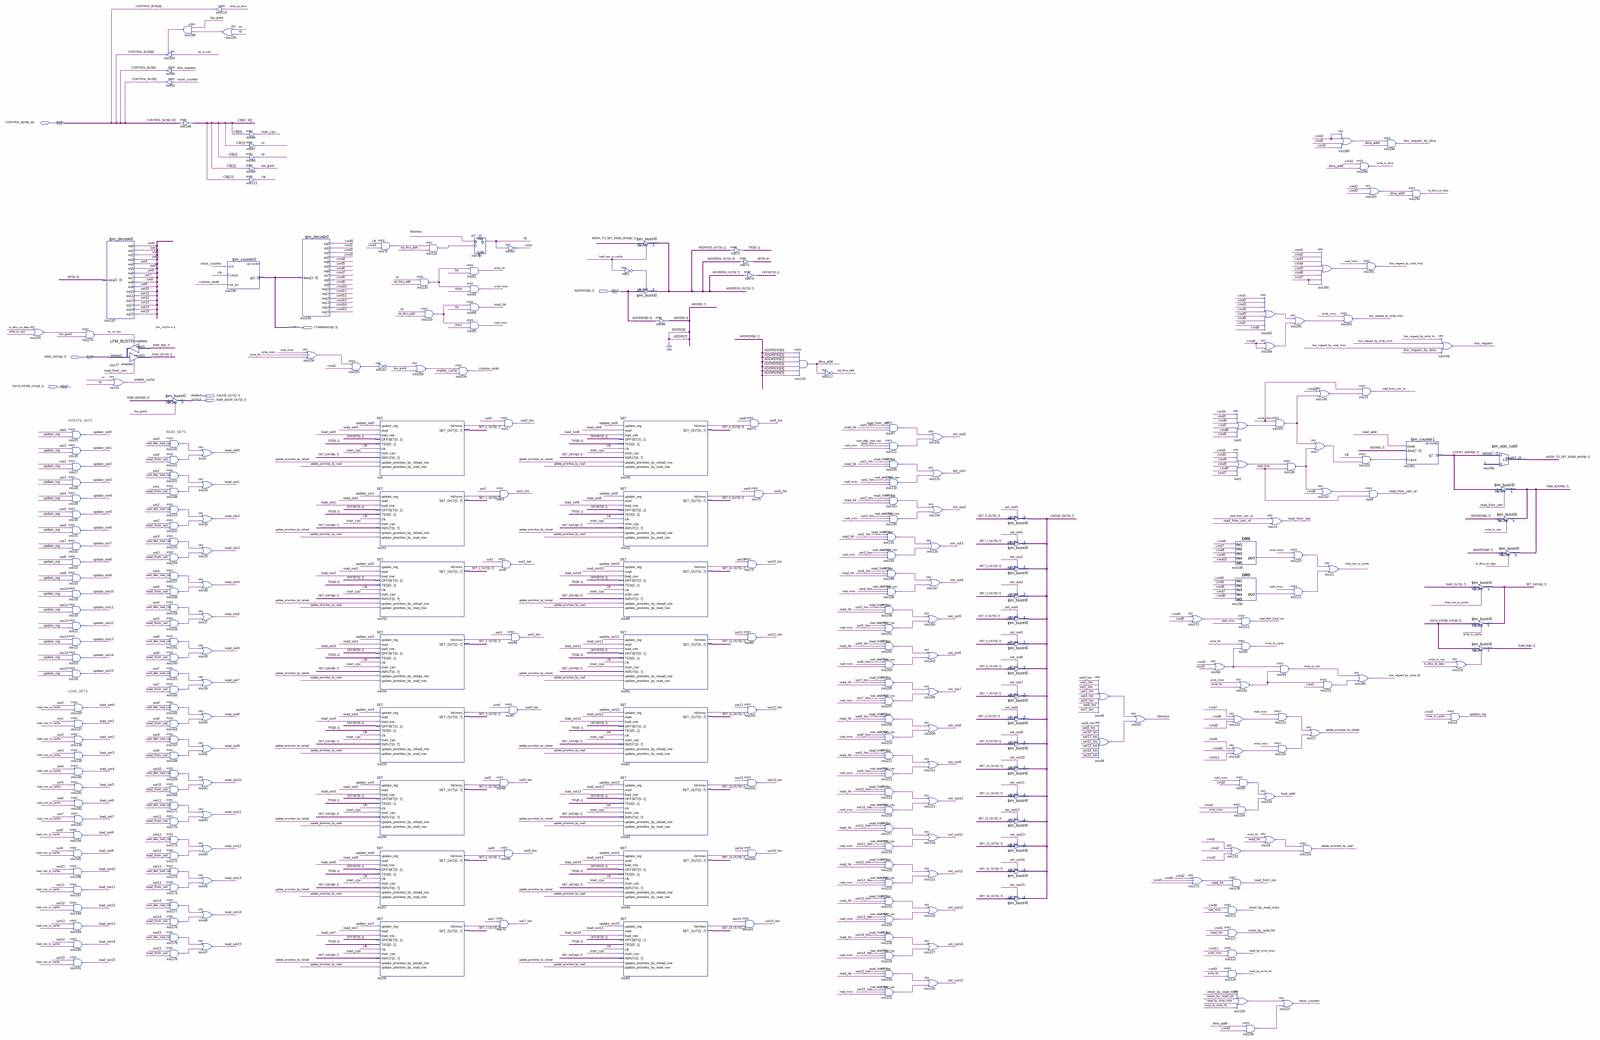
[diagram p0: schematic sheet, whole]
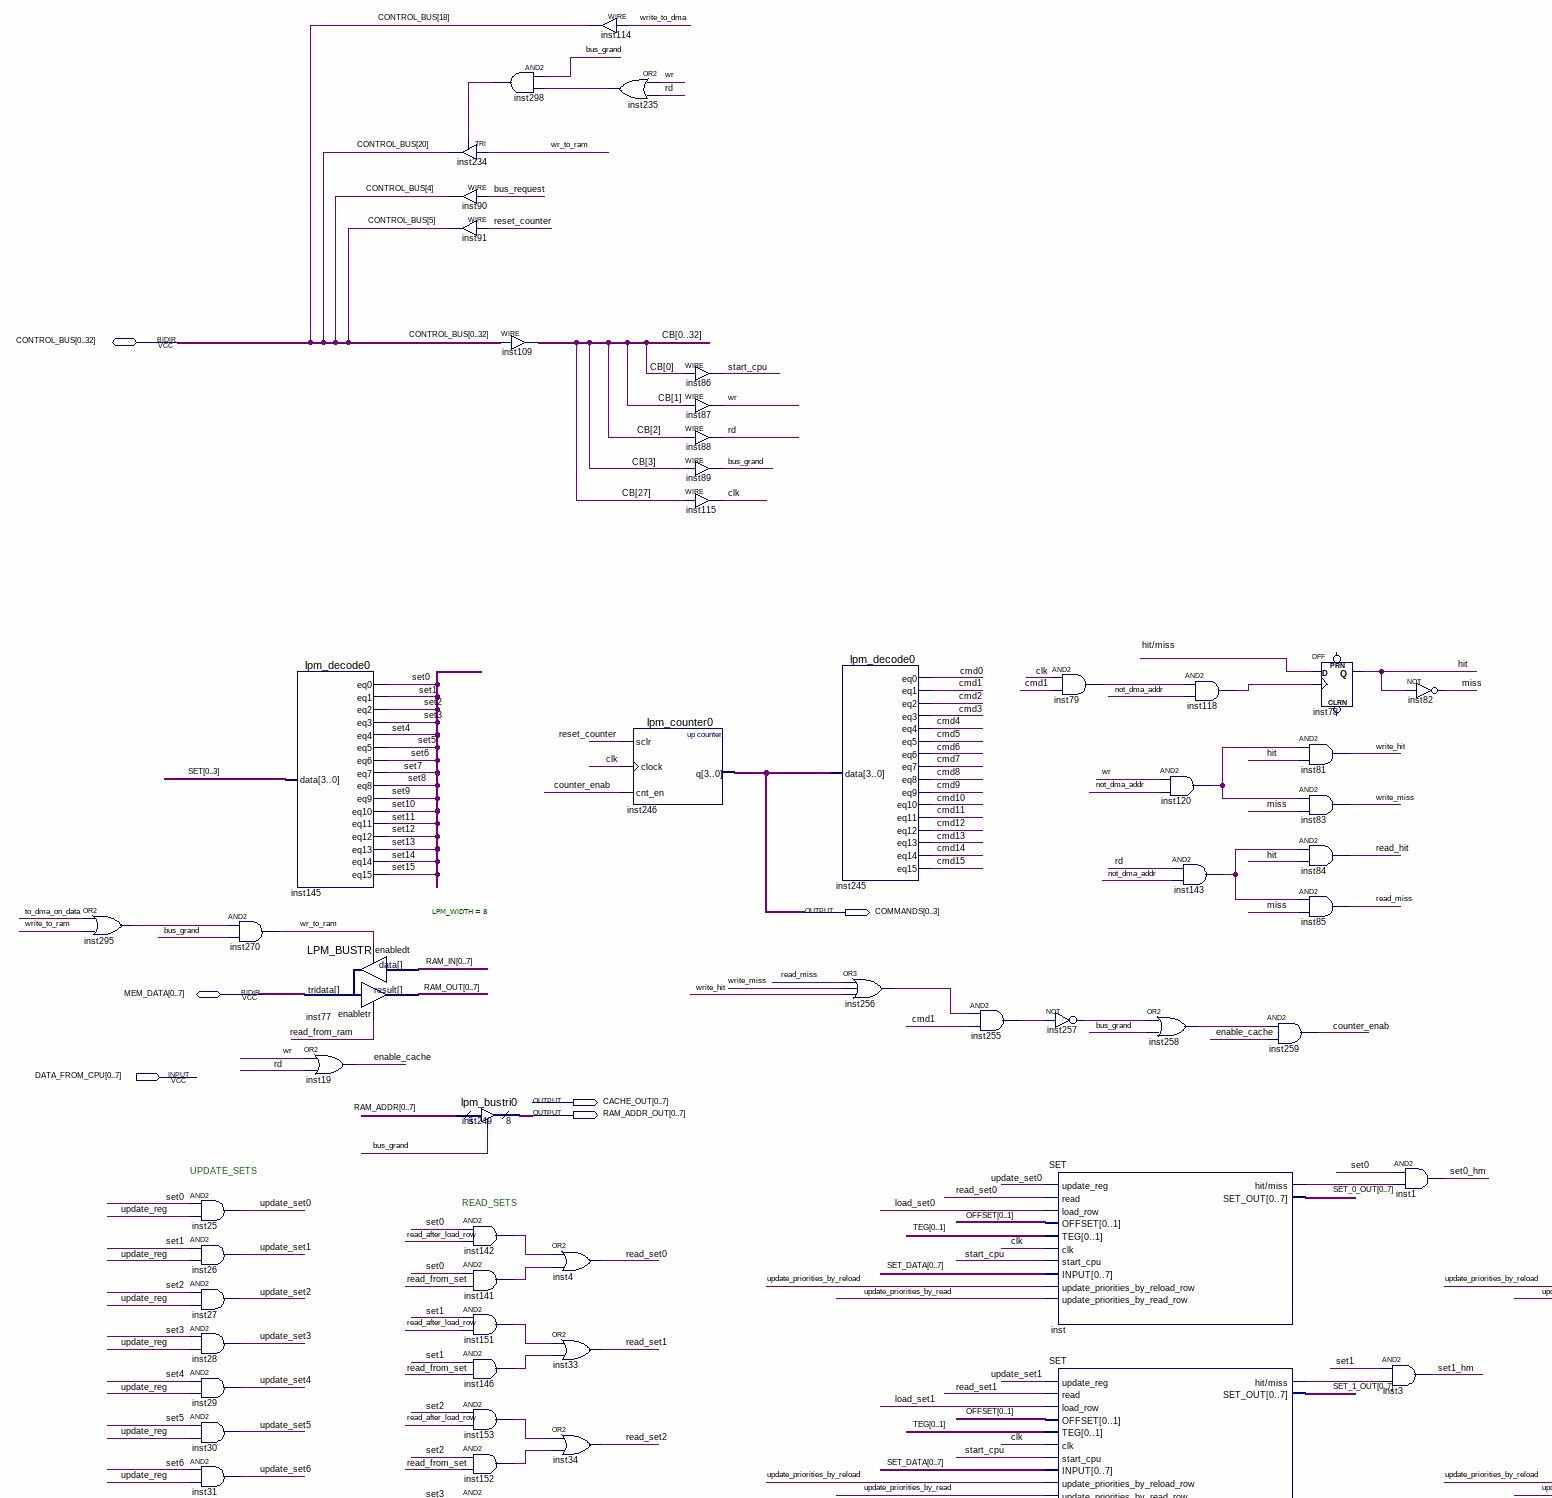
[diagram p1: schematic sheet, upper left part]
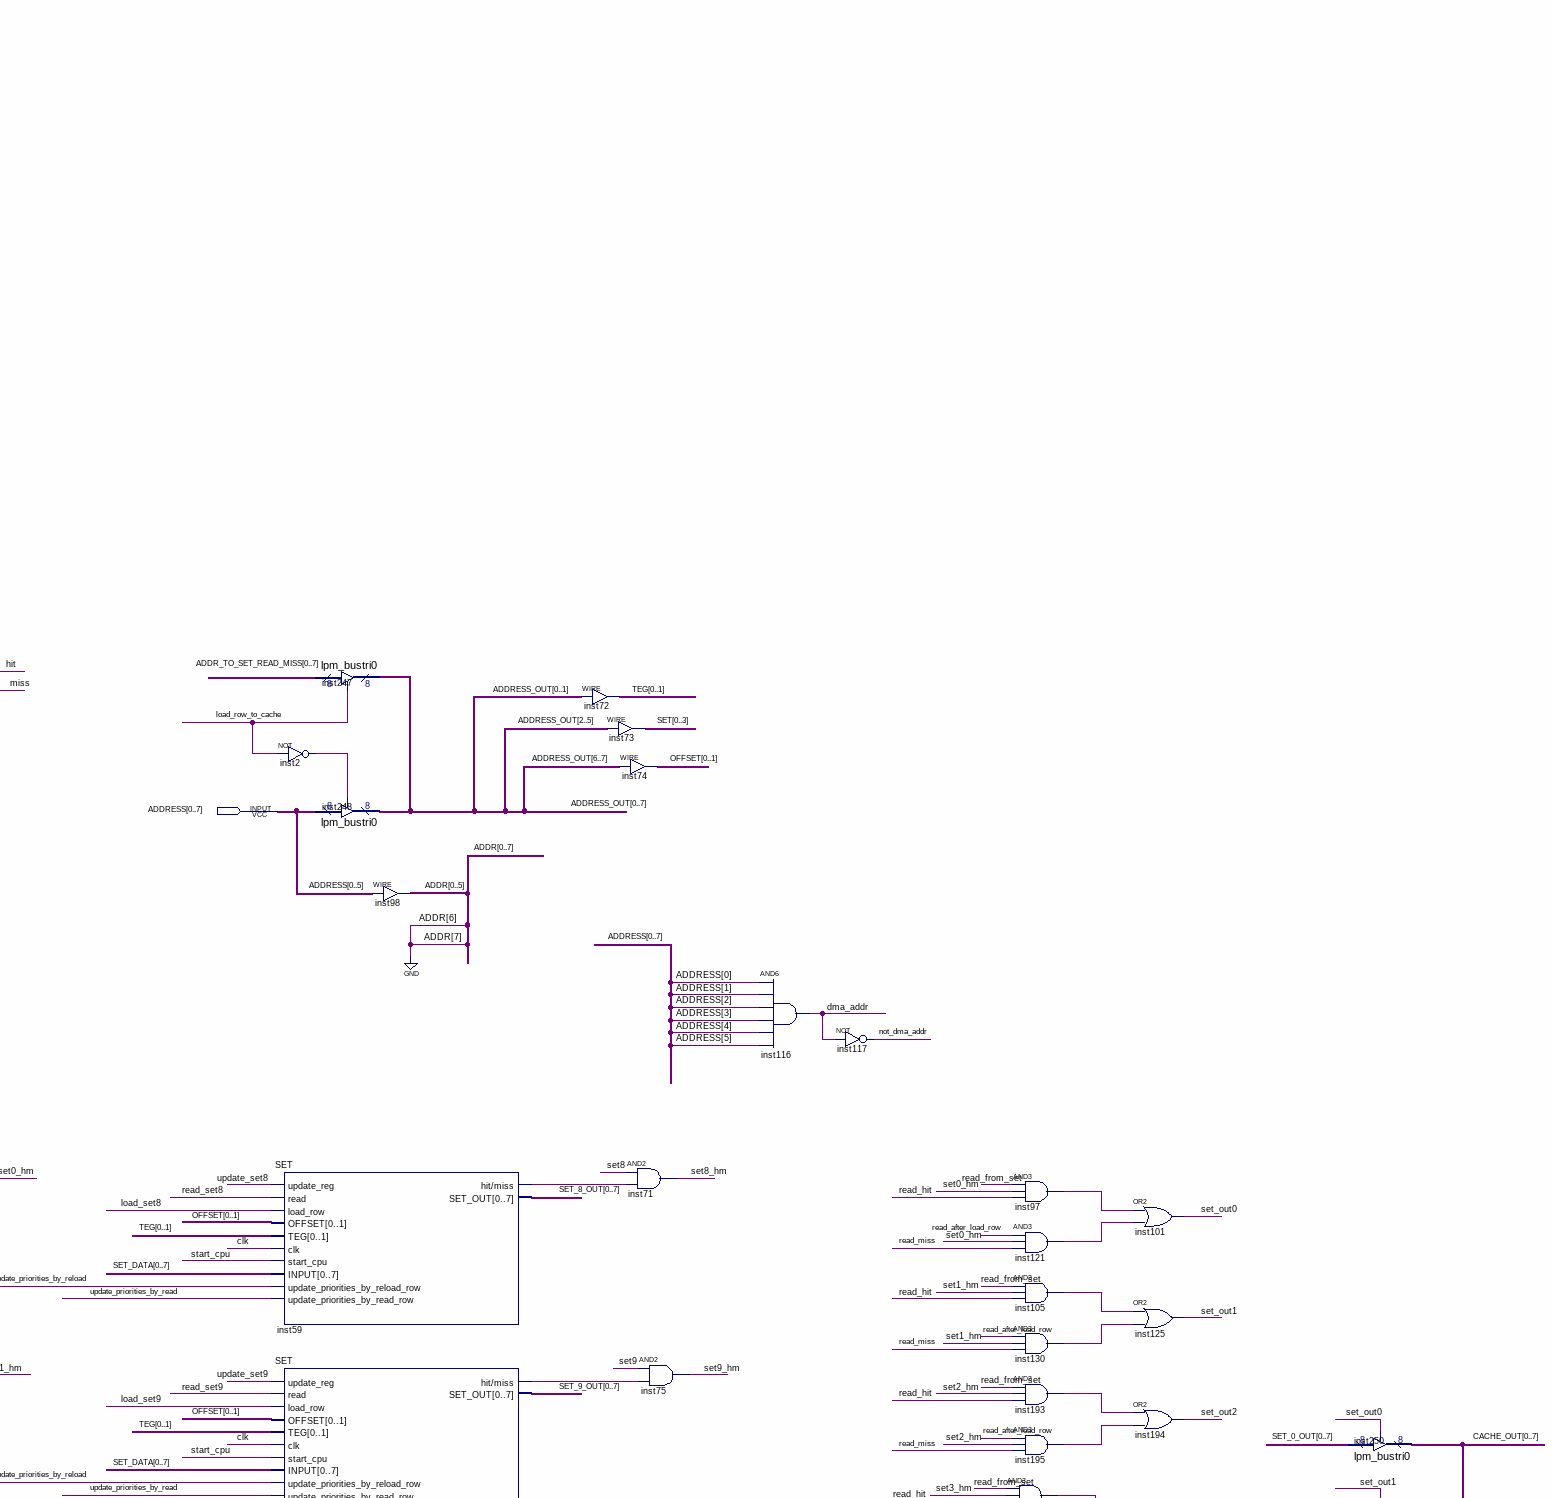
[diagram p2: schematic sheet, upper centre part]
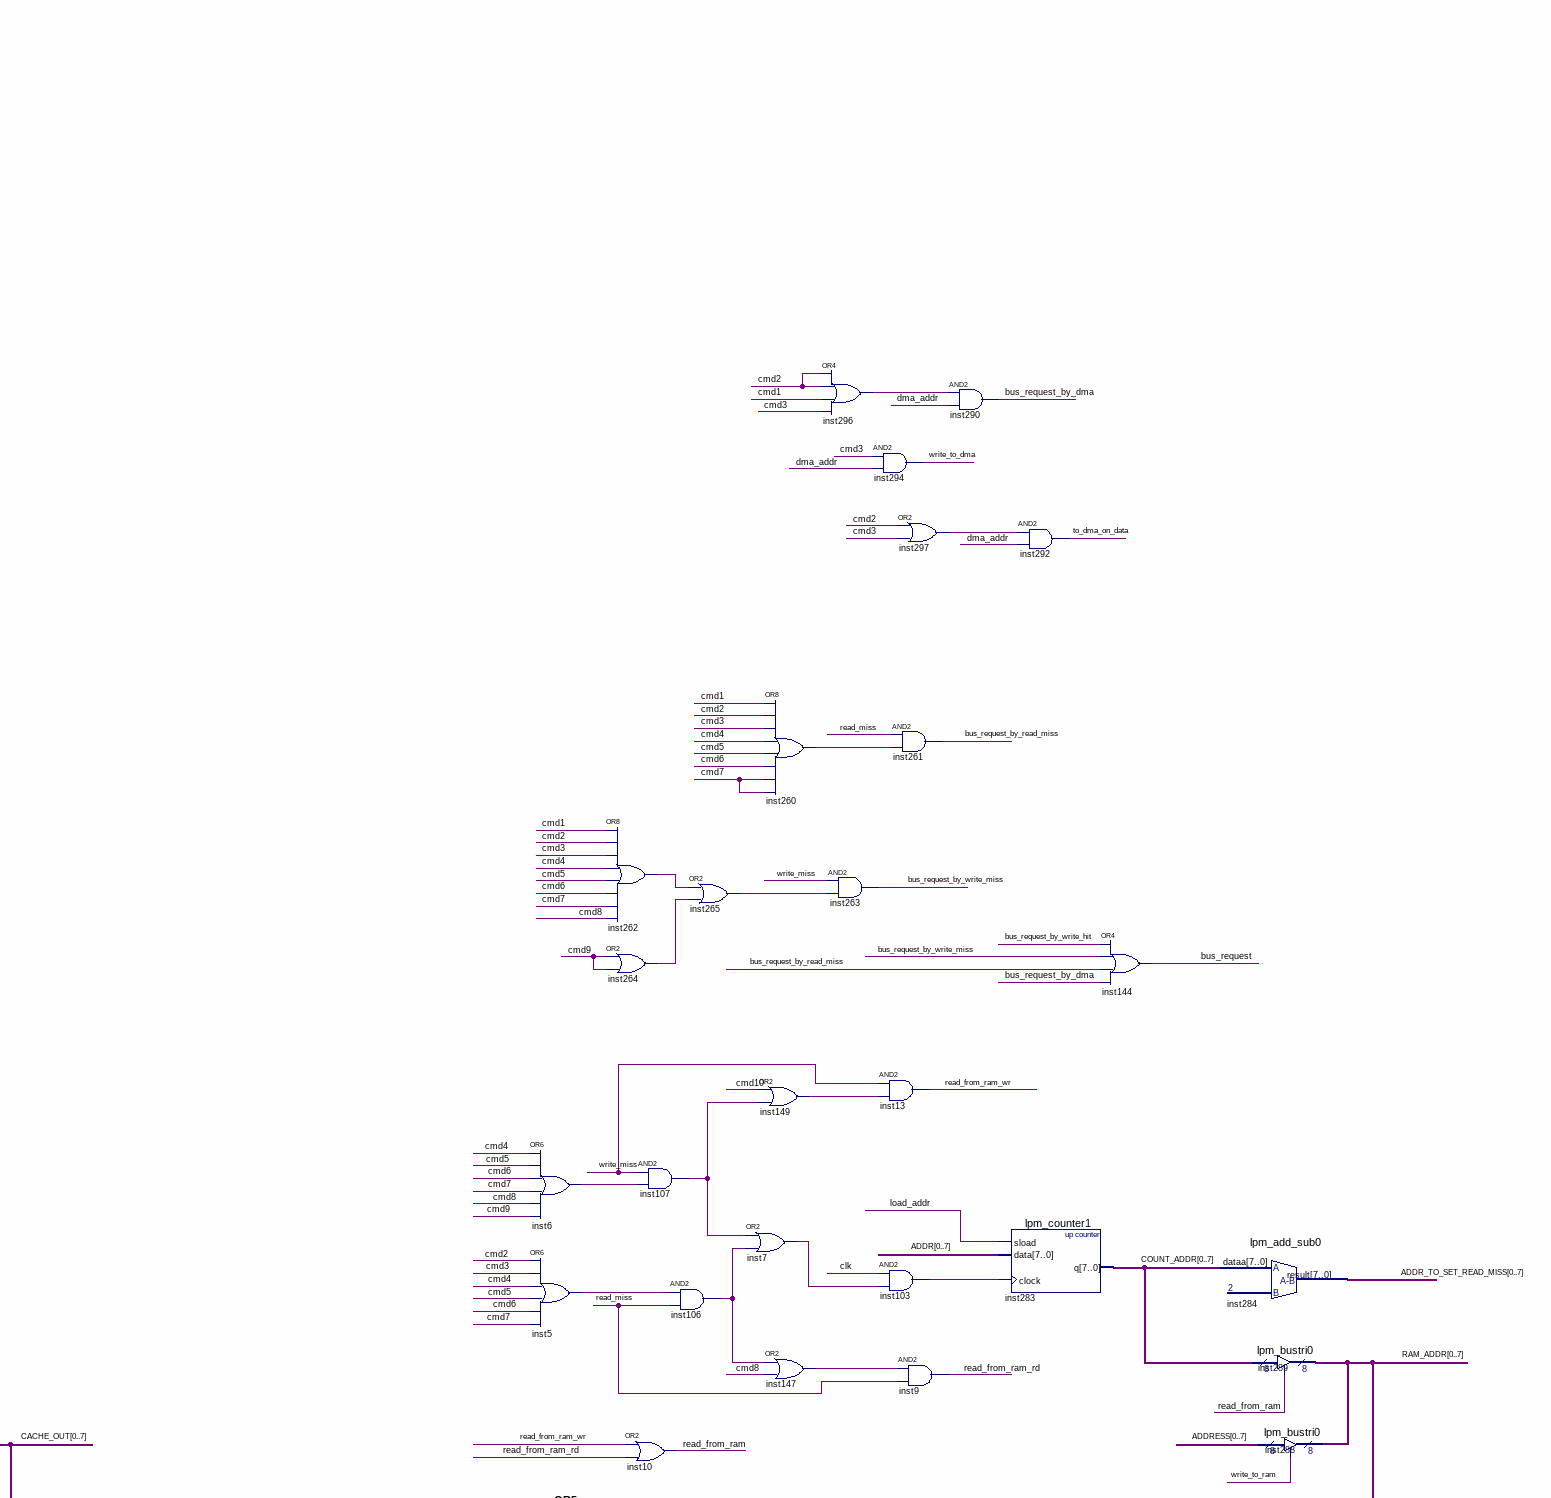
[diagram p3: schematic sheet, upper right part]
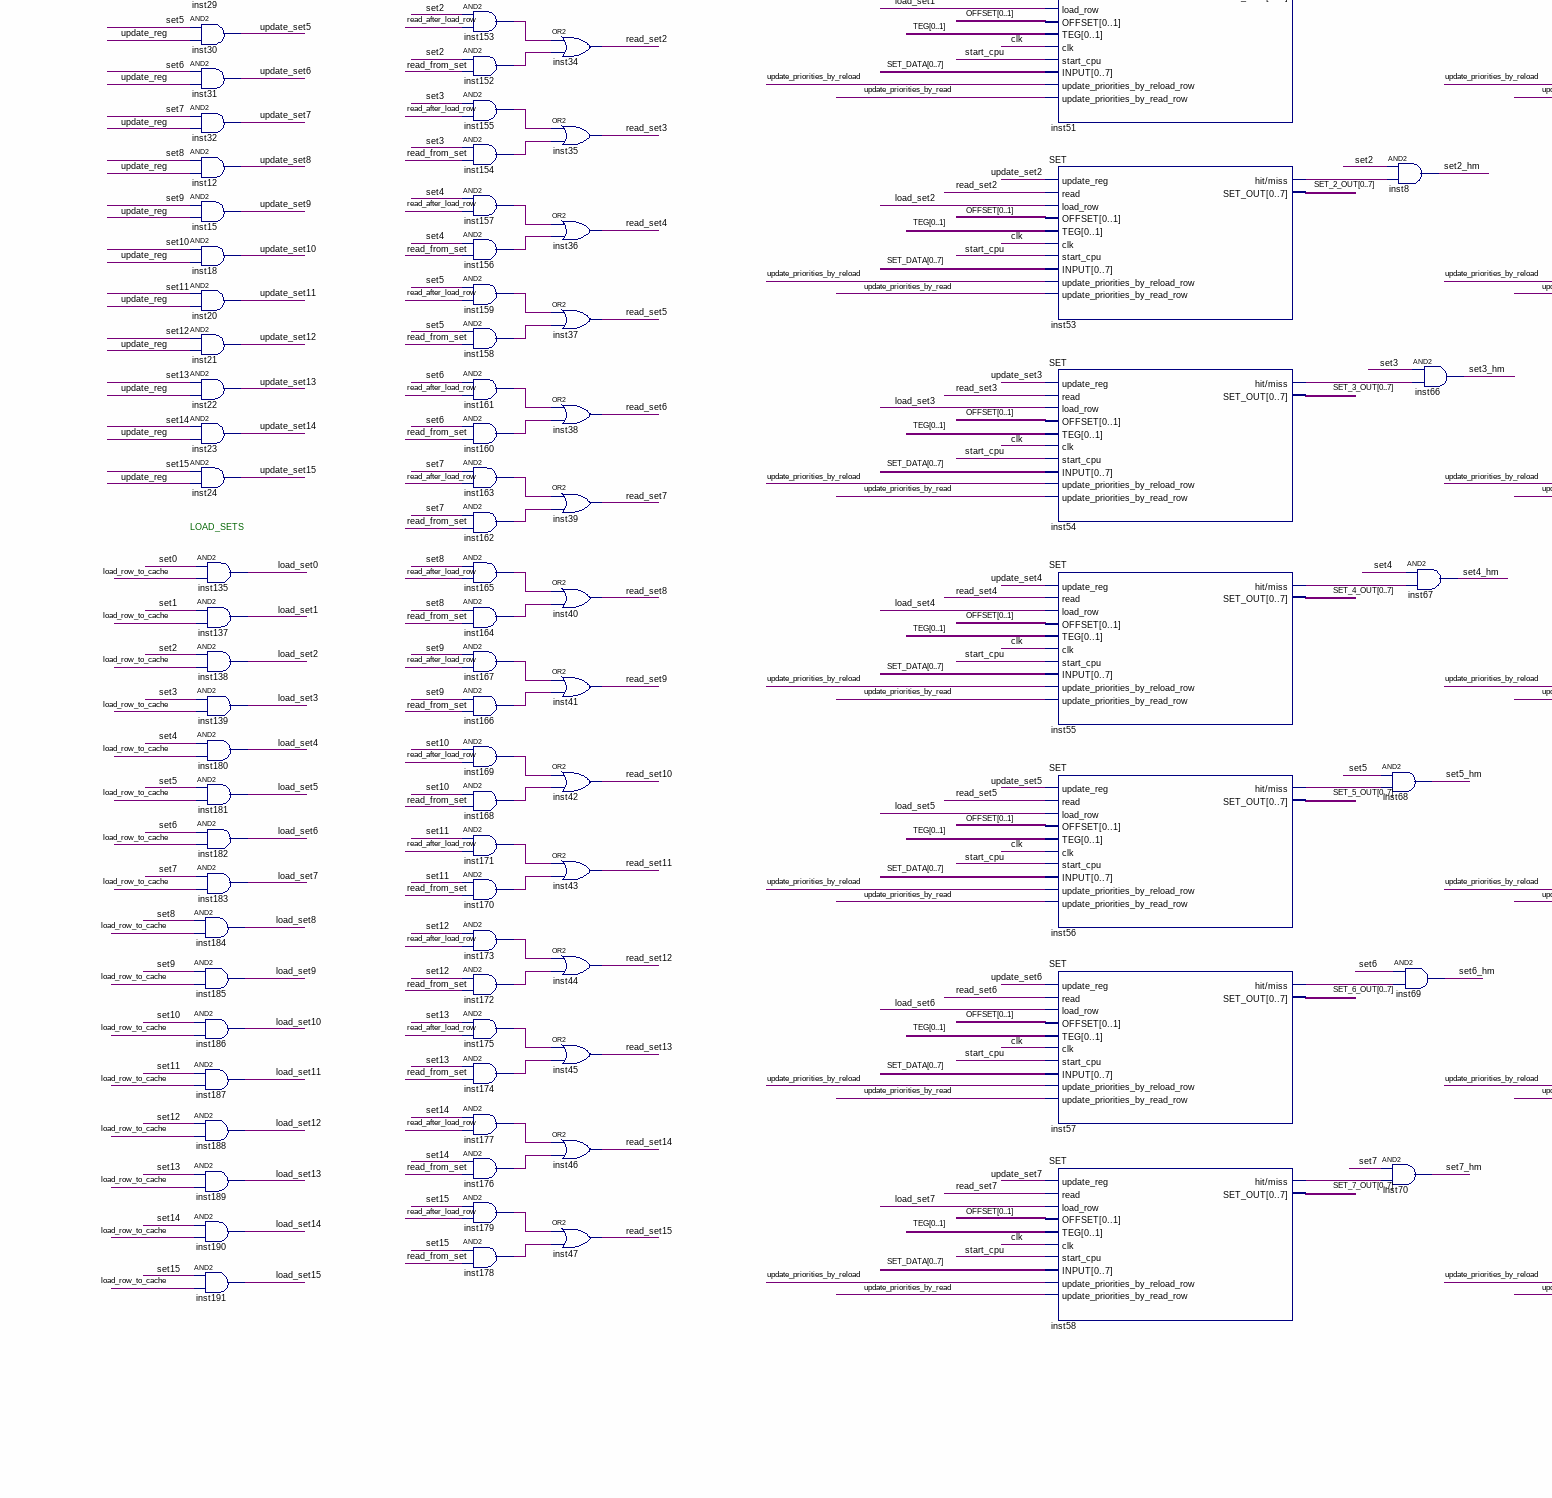
[diagram p4: schematic sheet, lower left part]
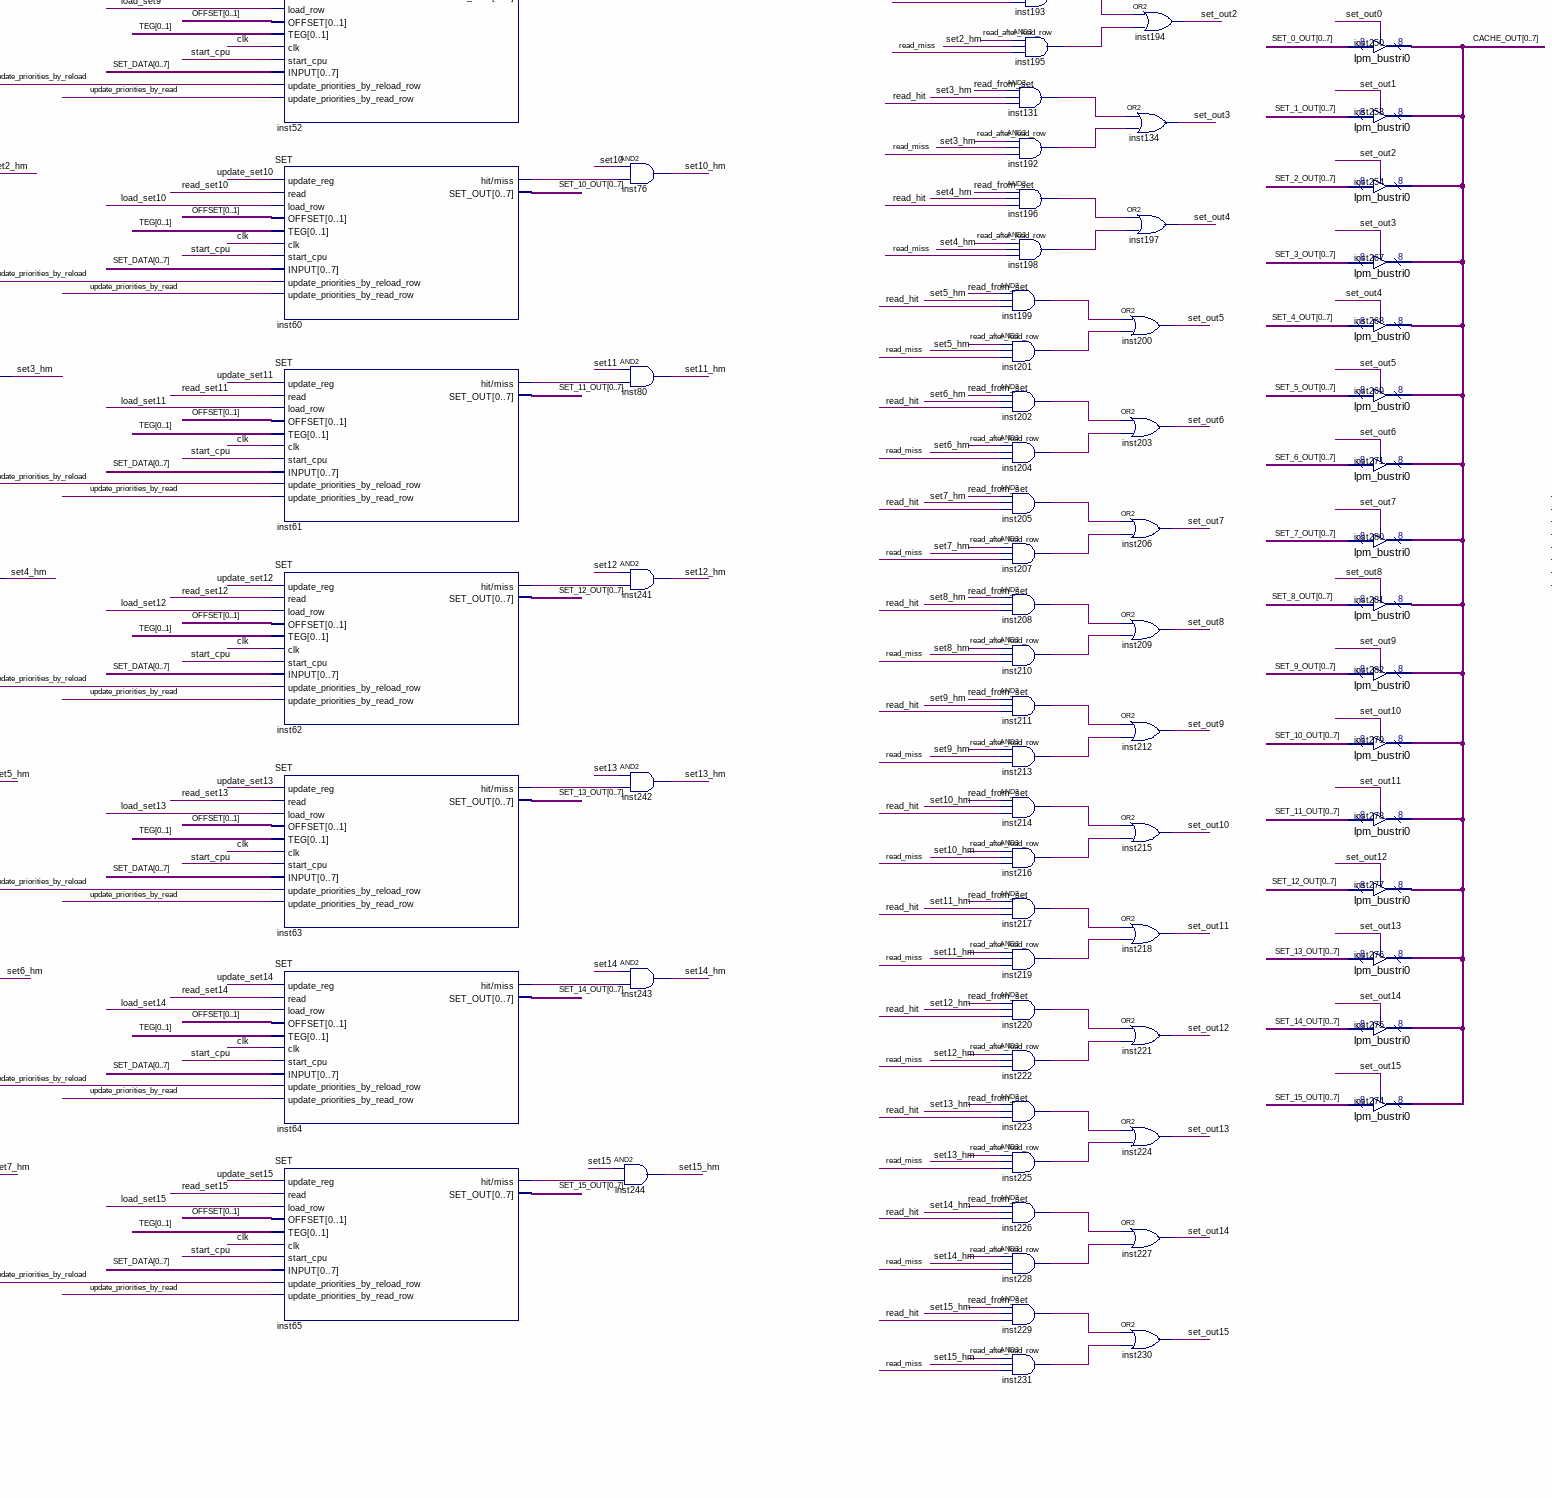
[diagram p5: schematic sheet, lower centre part]
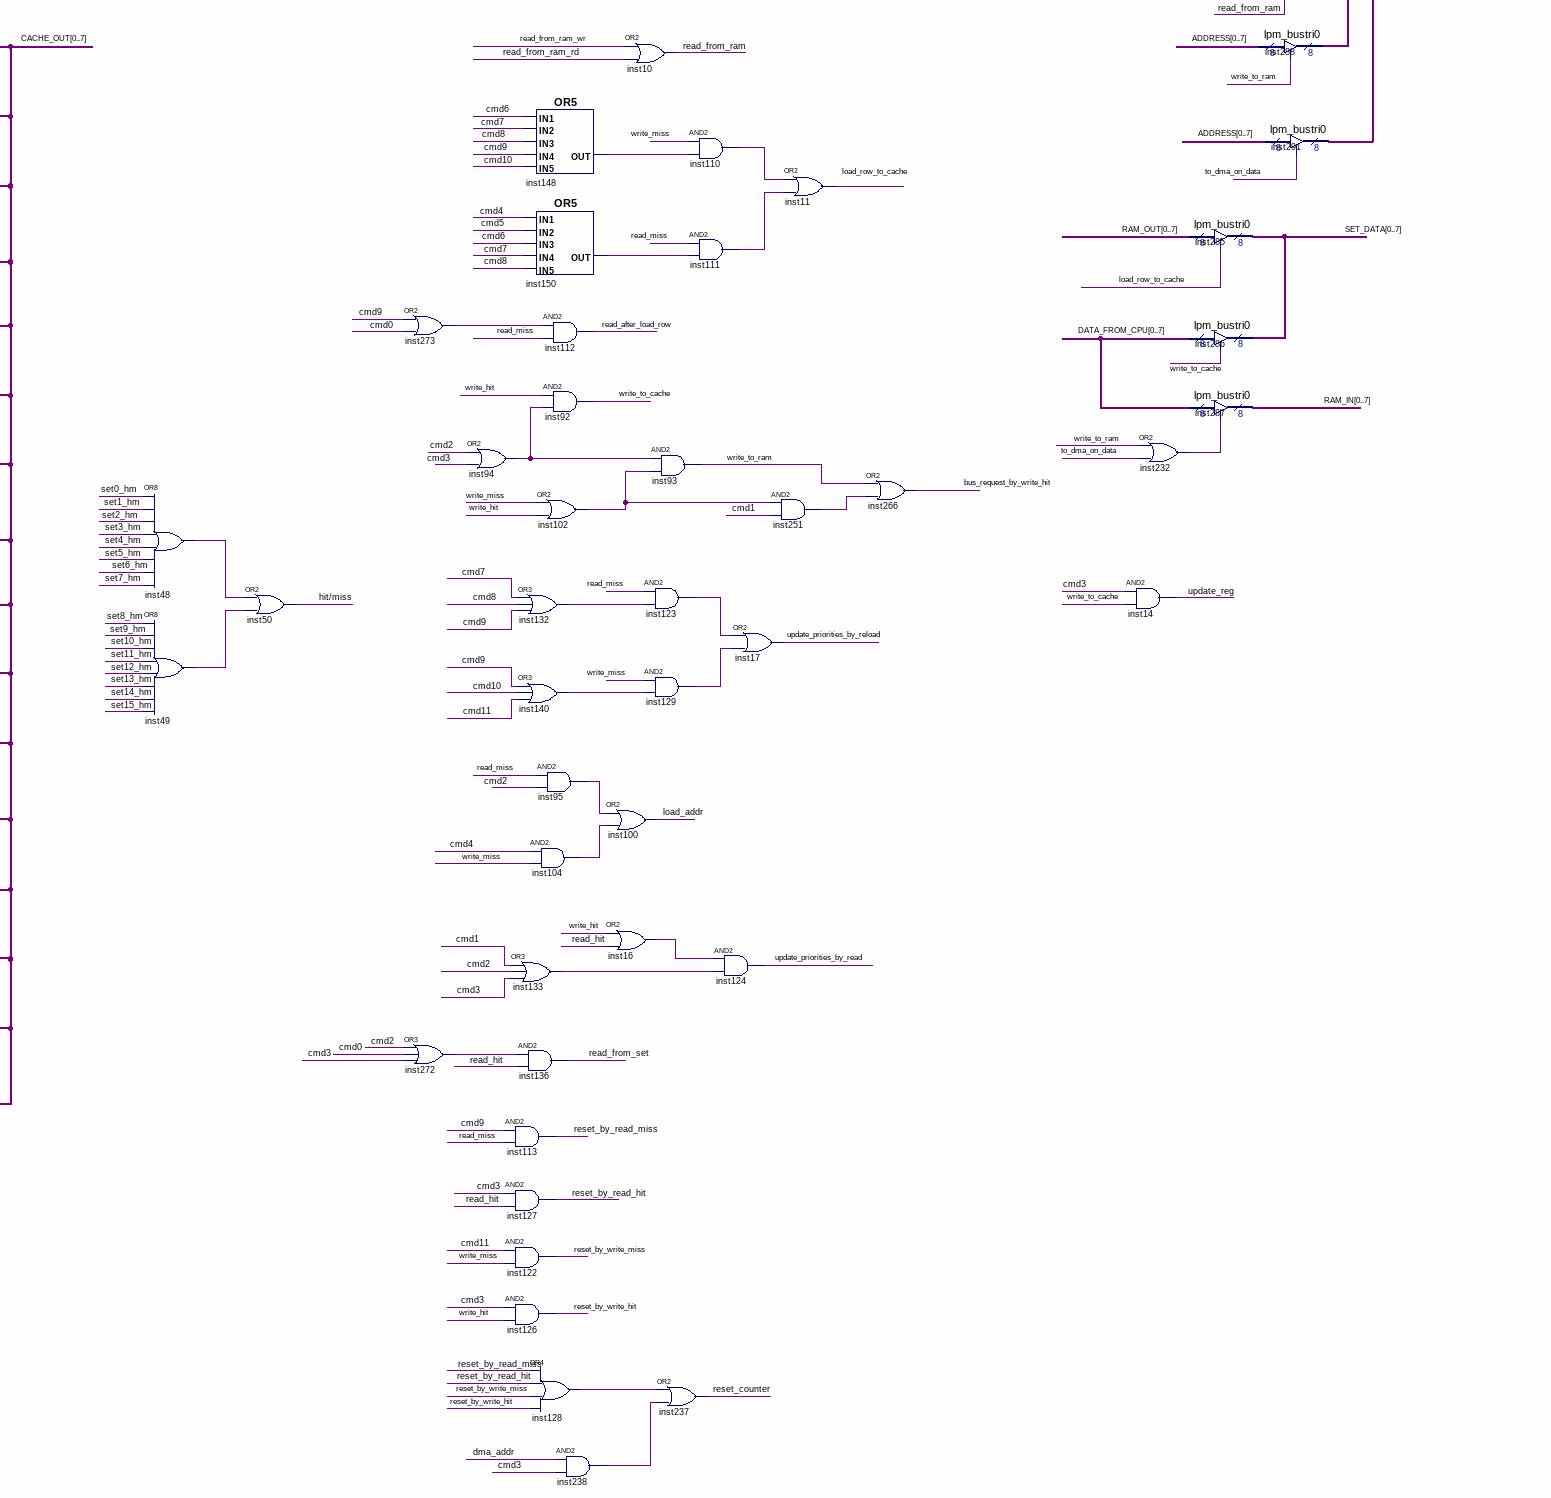
[diagram p6: schematic sheet, lower right part]
// Quartus schematic CACHE.bdf as structural Verilog: 289 symbols, 7 pins
module CACHE (
  input  [0:7] ADDRESS,
  input  [0:7] DATA_FROM_CPU,
  inout  [0:32] CONTROL_BUS,
  inout  [0:7] MEM_DATA,
  output [0:3] COMMANDS,
  output [0:7] CACHE_OUT,
  output [0:7] RAM_ADDR_OUT
);

  wire bus_grand, bus_request, bus_request_by_dma, bus_request_by_read_miss, bus_request_by_write_hit,
       bus_request_by_write_miss, clk, cmd0, cmd1, cmd2, cmd3, cmd4, cmd5, cmd6, cmd7, cmd8, cmd9, cmd10,
       cmd11, cmd12, cmd13, cmd14, cmd15, counter_enab, dma_addr, enable_cache, hit, \hit/miss , inst2_out,
       inst5_out, inst6_out, inst7_out, inst16_out, inst48_out, inst49_out, inst51_hit_miss, inst52_hit_miss,
       inst53_hit_miss, inst54_hit_miss, inst55_hit_miss, inst56_hit_miss, inst57_hit_miss, inst58_hit_miss,
       inst59_hit_miss, inst60_hit_miss, inst61_hit_miss, inst62_hit_miss, inst63_hit_miss, inst64_hit_miss,
       inst65_hit_miss, inst79_out, inst94_out, inst95_out, inst97_out, inst102_out, inst103_out,
       inst104_out, inst105_out, inst106_out, inst107_out, inst110_out, inst111_out, inst118_out,
       inst120_out, inst121_out, inst123_out, inst128_out, inst129_out, inst130_out, inst131_out,
       inst132_out, inst133_out, inst140_out, inst141_out, inst142_out, inst143_out, inst146_out,
       inst147_out, inst148_out, inst149_out, inst150_out, inst151_out, inst152_out, inst153_out,
       inst154_out, inst155_out, inst156_out, inst157_out, inst158_out, inst159_out, inst160_out,
       inst161_out, inst162_out, inst163_out, inst164_out, inst165_out, inst166_out, inst167_out,
       inst168_out, inst169_out, inst170_out, inst171_out, inst172_out, inst173_out, inst174_out,
       inst175_out, inst176_out, inst177_out, inst178_out, inst179_out, inst192_out, inst193_out,
       inst195_out, inst196_out, inst198_out, inst199_out, inst201_out, inst202_out, inst204_out,
       inst205_out, inst207_out, inst208_out, inst210_out, inst211_out, inst213_out, inst214_out,
       inst216_out, inst217_out, inst219_out, inst220_out, inst222_out, inst223_out, inst225_out,
       inst226_out, inst228_out, inst229_out, inst231_out, inst232_out, inst235_out, inst238_out,
       inst251_out, inst255_out, inst256_out, inst257_out, inst258_out, inst260_out, inst262_out,
       inst264_out, inst265_out, inst272_out, inst273_out, inst295_out, inst296_out, inst297_out,
       inst298_out, inst_hit_miss, load_addr, load_row_to_cache, load_set0, load_set1, load_set2, load_set3,
       load_set4, load_set5, load_set6, load_set7, load_set8, load_set9, load_set10, load_set11, load_set12,
       load_set13, load_set14, load_set15, miss, not_dma_addr, rd, read_after_load_row, read_from_ram,
       read_from_ram_rd, read_from_ram_wr, read_from_set, read_hit, read_miss, read_set0, read_set1,
       read_set2, read_set3, read_set4, read_set5, read_set6, read_set7, read_set8, read_set9, read_set10,
       read_set11, read_set12, read_set13, read_set14, read_set15, reset_by_read_hit, reset_by_read_miss,
       reset_by_write_hit, reset_by_write_miss, reset_counter, set0_hm, set1_hm, set2_hm, set3_hm, set4,
       set4_hm, set5, set5_hm, set6, set6_hm, set7, set7_hm, set8, set8_hm, set9, set9_hm, set10, set10_hm,
       set11, set11_hm, set12, set12_hm, set13, set13_hm, set14, set14_hm, set15, set15_hm, set_out0,
       set_out1, set_out2, set_out3, set_out4, set_out5, set_out6, set_out7, set_out8, set_out9, set_out10,
       set_out11, set_out12, set_out13, set_out14, set_out15, start_cpu, to_dma_on_data,
       update_priorities_by_read, update_priorities_by_reload, update_reg, update_set0, update_set1,
       update_set2, update_set3, update_set4, update_set5, update_set6, update_set7, update_set8,
       update_set9, update_set10, update_set11, update_set12, update_set13, update_set14, update_set15, wr,
       wr_to_ram, write_hit, write_miss, write_to_cache, write_to_dma, write_to_ram;
  wire [1:0] OFFSET, TEG;
  wire [3:0] SET;
  wire [5:0] ADDR;
  wire [7:0] ADDR_TO_SET_READ_MISS, ADDRESS_OUT, COUNT_ADDR, RAM_ADDR, RAM_IN, RAM_OUT, SET_0_OUT, SET_1_OUT,
       SET_2_OUT, SET_3_OUT, SET_4_OUT, SET_5_OUT, SET_6_OUT, SET_7_OUT, SET_8_OUT, SET_9_OUT, SET_10_OUT,
       SET_11_OUT, SET_12_OUT, SET_13_OUT, SET_14_OUT, SET_15_OUT, SET_DATA;
  wire [32:0] CB;

  or inst295 (inst295_out, to_dma_on_data, write_to_ram);
  and inst25 (update_set0, SET[0], update_reg);
  and inst26 (update_set1, SET[1], update_reg);
  and inst27 (update_set2, SET[2], update_reg);
  and inst28 (update_set3, SET[3], update_reg);
  and inst29 (update_set4, set4, update_reg);
  and inst30 (update_set5, set5, update_reg);
  and inst31 (update_set6, set6, update_reg);
  and inst32 (update_set7, set7, update_reg);
  and inst12 (update_set8, set8, update_reg);
  and inst15 (update_set9, set9, update_reg);
  and inst18 (update_set10, set10, update_reg);
  and inst20 (update_set11, set11, update_reg);
  and inst21 (update_set12, set12, update_reg);
  and inst22 (update_set13, set13, update_reg);
  and inst23 (update_set14, set14, update_reg);
  and inst24 (update_set15, set15, update_reg);
  and inst135 (load_set0, SET[0], load_row_to_cache);
  and inst137 (load_set1, SET[1], load_row_to_cache);
  and inst138 (load_set2, SET[2], load_row_to_cache);
  and inst139 (load_set3, SET[3], load_row_to_cache);
  and inst180 (load_set4, set4, load_row_to_cache);
  and inst181 (load_set5, set5, load_row_to_cache);
  and inst182 (load_set6, set6, load_row_to_cache);
  and inst183 (load_set7, set7, load_row_to_cache);
  and inst184 (load_set8, set8, load_row_to_cache);
  and inst185 (load_set9, set9, load_row_to_cache);
  and inst186 (load_set10, set10, load_row_to_cache);
  and inst187 (load_set11, set11, load_row_to_cache);
  and inst188 (load_set12, set12, load_row_to_cache);
  and inst189 (load_set13, set13, load_row_to_cache);
  and inst190 (load_set14, set14, load_row_to_cache);
  and inst191 (load_set15, set15, load_row_to_cache);
  and inst270 (wr_to_ram, inst295_out, bus_grand);
  lpm_decode0 inst145 (
    .data({SET[0], SET[1], SET[2], SET[3]}), .eq0(SET[0]), .eq1(SET[1]), .eq2(SET[2]), .eq3(SET[3]),
    .eq4(set4), .eq5(set5), .eq6(set6), .eq7(set7), .eq8(set8), .eq9(set9), .eq10(set10), .eq11(set11),
    .eq12(set12), .eq13(set13), .eq14(set14), .eq15(set15));
  LPM_BUSTRI #(.LPM_WIDTH(8)) inst77 (
    .data({RAM_IN[0], RAM_IN[1], RAM_IN[2], RAM_IN[3], RAM_IN[4], RAM_IN[5], RAM_IN[6], RAM_IN[7]}),
    .enabledt(wr_to_ram), .enabletr(read_from_ram),
    .result({RAM_OUT[0], RAM_OUT[1], RAM_OUT[2], RAM_OUT[3], RAM_OUT[4], RAM_OUT[5], RAM_OUT[6], RAM_OUT[7]}),
    .tridata(MEM_DATA));
  or inst19 (enable_cache, wr, rd);
  TRI inst234 (.IN(wr_to_ram), .OE(inst298_out), .OUT(CONTROL_BUS[20]));
  assign CONTROL_BUS[4] = bus_request;  // WIRE inst90
  assign CONTROL_BUS[5] = reset_counter;  // WIRE inst91
  lpm_bustri0 inst249 (
    .enabledt(bus_grand),
    .data({RAM_ADDR[0], RAM_ADDR[1], RAM_ADDR[2], RAM_ADDR[3], RAM_ADDR[4], RAM_ADDR[5], RAM_ADDR[6], RAM_ADDR[7]}),
    .tridata(RAM_ADDR_OUT));
  and inst298 (inst298_out, bus_grand, inst235_out);
  assign {CB[0], CB[1], CB[2], CB[3], CB[4], CB[5], CB[6], CB[7], CB[8], CB[9], CB[10], CB[11], CB[12], CB[13], CB[14], CB[15], CB[16], CB[17], CB[18], CB[19], CB[20], CB[21], CB[22], CB[23], CB[24], CB[25], CB[26], CB[27], CB[28], CB[29], CB[30], CB[31], CB[32]} = CONTROL_BUS;  // WIRE inst109
  and inst142 (inst142_out, SET[0], read_after_load_row);
  and inst141 (inst141_out, SET[0], read_from_set);
  and inst151 (inst151_out, SET[1], read_after_load_row);
  and inst146 (inst146_out, SET[1], read_from_set);
  and inst153 (inst153_out, SET[2], read_after_load_row);
  and inst152 (inst152_out, SET[2], read_from_set);
  and inst155 (inst155_out, SET[3], read_after_load_row);
  and inst154 (inst154_out, SET[3], read_from_set);
  and inst157 (inst157_out, set4, read_after_load_row);
  and inst156 (inst156_out, set4, read_from_set);
  and inst159 (inst159_out, set5, read_after_load_row);
  and inst158 (inst158_out, set5, read_from_set);
  and inst161 (inst161_out, set6, read_after_load_row);
  and inst160 (inst160_out, set6, read_from_set);
  and inst163 (inst163_out, set7, read_after_load_row);
  and inst162 (inst162_out, set7, read_from_set);
  and inst165 (inst165_out, set8, read_after_load_row);
  and inst164 (inst164_out, set8, read_from_set);
  and inst167 (inst167_out, set9, read_after_load_row);
  and inst166 (inst166_out, set9, read_from_set);
  and inst169 (inst169_out, set10, read_after_load_row);
  and inst168 (inst168_out, set10, read_from_set);
  and inst171 (inst171_out, set11, read_after_load_row);
  and inst170 (inst170_out, set11, read_from_set);
  and inst173 (inst173_out, set12, read_after_load_row);
  and inst172 (inst172_out, set12, read_from_set);
  and inst175 (inst175_out, set13, read_after_load_row);
  and inst174 (inst174_out, set13, read_from_set);
  and inst177 (inst177_out, set14, read_after_load_row);
  and inst176 (inst176_out, set14, read_from_set);
  and inst179 (inst179_out, set15, read_after_load_row);
  and inst178 (inst178_out, set15, read_from_set);
  or inst4 (read_set0, inst142_out, inst141_out);
  or inst33 (read_set1, inst151_out, inst146_out);
  or inst34 (read_set2, inst153_out, inst152_out);
  or inst35 (read_set3, inst155_out, inst154_out);
  or inst36 (read_set4, inst157_out, inst156_out);
  or inst37 (read_set5, inst159_out, inst158_out);
  or inst38 (read_set6, inst161_out, inst160_out);
  or inst39 (read_set7, inst163_out, inst162_out);
  or inst40 (read_set8, inst165_out, inst164_out);
  or inst41 (read_set9, inst167_out, inst166_out);
  or inst42 (read_set10, inst169_out, inst168_out);
  or inst43 (read_set11, inst171_out, inst170_out);
  or inst44 (read_set12, inst173_out, inst172_out);
  or inst45 (read_set13, inst175_out, inst174_out);
  or inst46 (read_set14, inst177_out, inst176_out);
  or inst47 (read_set15, inst179_out, inst178_out);
  assign CONTROL_BUS[18] = write_to_dma;  // WIRE inst114
  or inst235 (inst235_out, wr, rd);
  lpm_counter0 inst246 (.sclr(reset_counter), .clock(clk), .cnt_en(counter_enab), .q(COMMANDS));
  assign start_cpu = CB[0];  // WIRE inst86
  assign wr = CB[1];  // WIRE inst87
  assign rd = CB[2];  // WIRE inst88
  assign bus_grand = CB[3];  // WIRE inst89
  assign clk = CB[27];  // WIRE inst115
  lpm_decode0 inst245 (
    .data(COMMANDS), .eq0(cmd0), .eq1(cmd1), .eq2(cmd2), .eq3(cmd3), .eq4(cmd4), .eq5(cmd5), .eq6(cmd6),
    .eq7(cmd7), .eq8(cmd8), .eq9(cmd9), .eq10(cmd10), .eq11(cmd11), .eq12(cmd12), .eq13(cmd13), .eq14(cmd14),
    .eq15(cmd15));
  or inst256 (inst256_out, read_miss, write_miss, write_hit);
  and inst255 (inst255_out, inst256_out, cmd1);
  and inst79 (inst79_out, clk, cmd1);
  not inst257 (inst257_out, inst255_out);
  SET inst (
    .update_reg(update_set0), .read(read_set0), .load_row(load_set0), .OFFSET({OFFSET[0], OFFSET[1]}),
    .TEG({TEG[0], TEG[1]}), .clk(clk), .start_cpu(start_cpu),
    .INPUT({SET_DATA[0], SET_DATA[1], SET_DATA[2], SET_DATA[3], SET_DATA[4], SET_DATA[5], SET_DATA[6], SET_DATA[7]}),
    .update_priorities_by_reload_row(update_priorities_by_reload),
    .update_priorities_by_read_row(update_priorities_by_read), .\hit/miss (inst_hit_miss),
    .SET_OUT({SET_0_OUT[0], SET_0_OUT[1], SET_0_OUT[2], SET_0_OUT[3], SET_0_OUT[4], SET_0_OUT[5], SET_0_OUT[6], SET_0_OUT[7]}));
  SET inst51 (
    .update_reg(update_set1), .read(read_set1), .load_row(load_set1), .OFFSET({OFFSET[0], OFFSET[1]}),
    .TEG({TEG[0], TEG[1]}), .clk(clk), .start_cpu(start_cpu),
    .INPUT({SET_DATA[0], SET_DATA[1], SET_DATA[2], SET_DATA[3], SET_DATA[4], SET_DATA[5], SET_DATA[6], SET_DATA[7]}),
    .update_priorities_by_reload_row(update_priorities_by_reload),
    .update_priorities_by_read_row(update_priorities_by_read), .\hit/miss (inst51_hit_miss),
    .SET_OUT({SET_1_OUT[0], SET_1_OUT[1], SET_1_OUT[2], SET_1_OUT[3], SET_1_OUT[4], SET_1_OUT[5], SET_1_OUT[6], SET_1_OUT[7]}));
  SET inst53 (
    .update_reg(update_set2), .read(read_set2), .load_row(load_set2), .OFFSET({OFFSET[0], OFFSET[1]}),
    .TEG({TEG[0], TEG[1]}), .clk(clk), .start_cpu(start_cpu),
    .INPUT({SET_DATA[0], SET_DATA[1], SET_DATA[2], SET_DATA[3], SET_DATA[4], SET_DATA[5], SET_DATA[6], SET_DATA[7]}),
    .update_priorities_by_reload_row(update_priorities_by_reload),
    .update_priorities_by_read_row(update_priorities_by_read), .\hit/miss (inst53_hit_miss),
    .SET_OUT({SET_2_OUT[0], SET_2_OUT[1], SET_2_OUT[2], SET_2_OUT[3], SET_2_OUT[4], SET_2_OUT[5], SET_2_OUT[6], SET_2_OUT[7]}));
  SET inst54 (
    .update_reg(update_set3), .read(read_set3), .load_row(load_set3), .OFFSET({OFFSET[0], OFFSET[1]}),
    .TEG({TEG[0], TEG[1]}), .clk(clk), .start_cpu(start_cpu),
    .INPUT({SET_DATA[0], SET_DATA[1], SET_DATA[2], SET_DATA[3], SET_DATA[4], SET_DATA[5], SET_DATA[6], SET_DATA[7]}),
    .update_priorities_by_reload_row(update_priorities_by_reload),
    .update_priorities_by_read_row(update_priorities_by_read), .\hit/miss (inst54_hit_miss),
    .SET_OUT({SET_3_OUT[0], SET_3_OUT[1], SET_3_OUT[2], SET_3_OUT[3], SET_3_OUT[4], SET_3_OUT[5], SET_3_OUT[6], SET_3_OUT[7]}));
  SET inst55 (
    .update_reg(update_set4), .read(read_set4), .load_row(load_set4), .OFFSET({OFFSET[0], OFFSET[1]}),
    .TEG({TEG[0], TEG[1]}), .clk(clk), .start_cpu(start_cpu),
    .INPUT({SET_DATA[0], SET_DATA[1], SET_DATA[2], SET_DATA[3], SET_DATA[4], SET_DATA[5], SET_DATA[6], SET_DATA[7]}),
    .update_priorities_by_reload_row(update_priorities_by_reload),
    .update_priorities_by_read_row(update_priorities_by_read), .\hit/miss (inst55_hit_miss),
    .SET_OUT({SET_4_OUT[0], SET_4_OUT[1], SET_4_OUT[2], SET_4_OUT[3], SET_4_OUT[4], SET_4_OUT[5], SET_4_OUT[6], SET_4_OUT[7]}));
  SET inst56 (
    .update_reg(update_set5), .read(read_set5), .load_row(load_set5), .OFFSET({OFFSET[0], OFFSET[1]}),
    .TEG({TEG[0], TEG[1]}), .clk(clk), .start_cpu(start_cpu),
    .INPUT({SET_DATA[0], SET_DATA[1], SET_DATA[2], SET_DATA[3], SET_DATA[4], SET_DATA[5], SET_DATA[6], SET_DATA[7]}),
    .update_priorities_by_reload_row(update_priorities_by_reload),
    .update_priorities_by_read_row(update_priorities_by_read), .\hit/miss (inst56_hit_miss),
    .SET_OUT({SET_5_OUT[0], SET_5_OUT[1], SET_5_OUT[2], SET_5_OUT[3], SET_5_OUT[4], SET_5_OUT[5], SET_5_OUT[6], SET_5_OUT[7]}));
  SET inst57 (
    .update_reg(update_set6), .read(read_set6), .load_row(load_set6), .OFFSET({OFFSET[0], OFFSET[1]}),
    .TEG({TEG[0], TEG[1]}), .clk(clk), .start_cpu(start_cpu),
    .INPUT({SET_DATA[0], SET_DATA[1], SET_DATA[2], SET_DATA[3], SET_DATA[4], SET_DATA[5], SET_DATA[6], SET_DATA[7]}),
    .update_priorities_by_reload_row(update_priorities_by_reload),
    .update_priorities_by_read_row(update_priorities_by_read), .\hit/miss (inst57_hit_miss),
    .SET_OUT({SET_6_OUT[0], SET_6_OUT[1], SET_6_OUT[2], SET_6_OUT[3], SET_6_OUT[4], SET_6_OUT[5], SET_6_OUT[6], SET_6_OUT[7]}));
  SET inst58 (
    .update_reg(update_set7), .read(read_set7), .load_row(load_set7), .OFFSET({OFFSET[0], OFFSET[1]}),
    .TEG({TEG[0], TEG[1]}), .clk(clk), .start_cpu(start_cpu),
    .INPUT({SET_DATA[0], SET_DATA[1], SET_DATA[2], SET_DATA[3], SET_DATA[4], SET_DATA[5], SET_DATA[6], SET_DATA[7]}),
    .update_priorities_by_reload_row(update_priorities_by_reload),
    .update_priorities_by_read_row(update_priorities_by_read), .\hit/miss (inst58_hit_miss),
    .SET_OUT({SET_7_OUT[0], SET_7_OUT[1], SET_7_OUT[2], SET_7_OUT[3], SET_7_OUT[4], SET_7_OUT[5], SET_7_OUT[6], SET_7_OUT[7]}));
  and inst120 (inst120_out, wr, not_dma_addr);
  or inst258 (inst258_out, inst257_out, bus_grand);
  and inst118 (inst118_out, inst79_out, not_dma_addr);
  and inst143 (inst143_out, rd, not_dma_addr);
  and inst259 (counter_enab, inst258_out, enable_cache);
  DFF inst78 (.CLK(inst118_out), .D(\hit/miss ), .Q(hit));  // open: CLRN, PRN
  and inst81 (write_hit, inst120_out, hit);
  and inst83 (write_miss, inst120_out, miss);
  and inst84 (read_hit, inst143_out, hit);
  and inst85 (read_miss, inst143_out, miss);
  not inst82 (miss, hit);
  and inst1 (set0_hm, SET[0], inst_hit_miss);
  and inst3 (set1_hm, SET[1], inst51_hit_miss);
  and inst8 (set2_hm, SET[2], inst53_hit_miss);
  and inst66 (set3_hm, SET[3], inst54_hit_miss);
  and inst67 (set4_hm, set4, inst55_hit_miss);
  and inst68 (set5_hm, set5, inst56_hit_miss);
  and inst69 (set6_hm, set6, inst57_hit_miss);
  and inst70 (set7_hm, set7, inst58_hit_miss);
  SET inst59 (
    .update_reg(update_set8), .read(read_set8), .load_row(load_set8), .OFFSET({OFFSET[0], OFFSET[1]}),
    .TEG({TEG[0], TEG[1]}), .clk(clk), .start_cpu(start_cpu),
    .INPUT({SET_DATA[0], SET_DATA[1], SET_DATA[2], SET_DATA[3], SET_DATA[4], SET_DATA[5], SET_DATA[6], SET_DATA[7]}),
    .update_priorities_by_reload_row(update_priorities_by_reload),
    .update_priorities_by_read_row(update_priorities_by_read), .\hit/miss (inst59_hit_miss),
    .SET_OUT({SET_8_OUT[0], SET_8_OUT[1], SET_8_OUT[2], SET_8_OUT[3], SET_8_OUT[4], SET_8_OUT[5], SET_8_OUT[6], SET_8_OUT[7]}));
  SET inst52 (
    .update_reg(update_set9), .read(read_set9), .load_row(load_set9), .OFFSET({OFFSET[0], OFFSET[1]}),
    .TEG({TEG[0], TEG[1]}), .clk(clk), .start_cpu(start_cpu),
    .INPUT({SET_DATA[0], SET_DATA[1], SET_DATA[2], SET_DATA[3], SET_DATA[4], SET_DATA[5], SET_DATA[6], SET_DATA[7]}),
    .update_priorities_by_reload_row(update_priorities_by_reload),
    .update_priorities_by_read_row(update_priorities_by_read), .\hit/miss (inst52_hit_miss),
    .SET_OUT({SET_9_OUT[0], SET_9_OUT[1], SET_9_OUT[2], SET_9_OUT[3], SET_9_OUT[4], SET_9_OUT[5], SET_9_OUT[6], SET_9_OUT[7]}));
  SET inst60 (
    .update_reg(update_set10), .read(read_set10), .load_row(load_set10), .OFFSET({OFFSET[0], OFFSET[1]}),
    .TEG({TEG[0], TEG[1]}), .clk(clk), .start_cpu(start_cpu),
    .INPUT({SET_DATA[0], SET_DATA[1], SET_DATA[2], SET_DATA[3], SET_DATA[4], SET_DATA[5], SET_DATA[6], SET_DATA[7]}),
    .update_priorities_by_reload_row(update_priorities_by_reload),
    .update_priorities_by_read_row(update_priorities_by_read), .\hit/miss (inst60_hit_miss),
    .SET_OUT({SET_10_OUT[0], SET_10_OUT[1], SET_10_OUT[2], SET_10_OUT[3], SET_10_OUT[4], SET_10_OUT[5], SET_10_OUT[6], SET_10_OUT[7]}));
  SET inst61 (
    .update_reg(update_set11), .read(read_set11), .load_row(load_set11), .OFFSET({OFFSET[0], OFFSET[1]}),
    .TEG({TEG[0], TEG[1]}), .clk(clk), .start_cpu(start_cpu),
    .INPUT({SET_DATA[0], SET_DATA[1], SET_DATA[2], SET_DATA[3], SET_DATA[4], SET_DATA[5], SET_DATA[6], SET_DATA[7]}),
    .update_priorities_by_reload_row(update_priorities_by_reload),
    .update_priorities_by_read_row(update_priorities_by_read), .\hit/miss (inst61_hit_miss),
    .SET_OUT({SET_11_OUT[0], SET_11_OUT[1], SET_11_OUT[2], SET_11_OUT[3], SET_11_OUT[4], SET_11_OUT[5], SET_11_OUT[6], SET_11_OUT[7]}));
  SET inst62 (
    .update_reg(update_set12), .read(read_set12), .load_row(load_set12), .OFFSET({OFFSET[0], OFFSET[1]}),
    .TEG({TEG[0], TEG[1]}), .clk(clk), .start_cpu(start_cpu),
    .INPUT({SET_DATA[0], SET_DATA[1], SET_DATA[2], SET_DATA[3], SET_DATA[4], SET_DATA[5], SET_DATA[6], SET_DATA[7]}),
    .update_priorities_by_reload_row(update_priorities_by_reload),
    .update_priorities_by_read_row(update_priorities_by_read), .\hit/miss (inst62_hit_miss),
    .SET_OUT({SET_12_OUT[0], SET_12_OUT[1], SET_12_OUT[2], SET_12_OUT[3], SET_12_OUT[4], SET_12_OUT[5], SET_12_OUT[6], SET_12_OUT[7]}));
  SET inst63 (
    .update_reg(update_set13), .read(read_set13), .load_row(load_set13), .OFFSET({OFFSET[0], OFFSET[1]}),
    .TEG({TEG[0], TEG[1]}), .clk(clk), .start_cpu(start_cpu),
    .INPUT({SET_DATA[0], SET_DATA[1], SET_DATA[2], SET_DATA[3], SET_DATA[4], SET_DATA[5], SET_DATA[6], SET_DATA[7]}),
    .update_priorities_by_reload_row(update_priorities_by_reload),
    .update_priorities_by_read_row(update_priorities_by_read), .\hit/miss (inst63_hit_miss),
    .SET_OUT({SET_13_OUT[0], SET_13_OUT[1], SET_13_OUT[2], SET_13_OUT[3], SET_13_OUT[4], SET_13_OUT[5], SET_13_OUT[6], SET_13_OUT[7]}));
  SET inst64 (
    .update_reg(update_set14), .read(read_set14), .load_row(load_set14), .OFFSET({OFFSET[0], OFFSET[1]}),
    .TEG({TEG[0], TEG[1]}), .clk(clk), .start_cpu(start_cpu),
    .INPUT({SET_DATA[0], SET_DATA[1], SET_DATA[2], SET_DATA[3], SET_DATA[4], SET_DATA[5], SET_DATA[6], SET_DATA[7]}),
    .update_priorities_by_reload_row(update_priorities_by_reload),
    .update_priorities_by_read_row(update_priorities_by_read), .\hit/miss (inst64_hit_miss),
    .SET_OUT({SET_14_OUT[0], SET_14_OUT[1], SET_14_OUT[2], SET_14_OUT[3], SET_14_OUT[4], SET_14_OUT[5], SET_14_OUT[6], SET_14_OUT[7]}));
  SET inst65 (
    .update_reg(update_set15), .read(read_set15), .load_row(load_set15), .OFFSET({OFFSET[0], OFFSET[1]}),
    .TEG({TEG[0], TEG[1]}), .clk(clk), .start_cpu(start_cpu),
    .INPUT({SET_DATA[0], SET_DATA[1], SET_DATA[2], SET_DATA[3], SET_DATA[4], SET_DATA[5], SET_DATA[6], SET_DATA[7]}),
    .update_priorities_by_reload_row(update_priorities_by_reload),
    .update_priorities_by_read_row(update_priorities_by_read), .\hit/miss (inst65_hit_miss),
    .SET_OUT({SET_15_OUT[0], SET_15_OUT[1], SET_15_OUT[2], SET_15_OUT[3], SET_15_OUT[4], SET_15_OUT[5], SET_15_OUT[6], SET_15_OUT[7]}));
  lpm_bustri0 inst247 (
    .enabledt(load_row_to_cache),
    .data({ADDR_TO_SET_READ_MISS[0], ADDR_TO_SET_READ_MISS[1], ADDR_TO_SET_READ_MISS[2], ADDR_TO_SET_READ_MISS[3], ADDR_TO_SET_READ_MISS[4], ADDR_TO_SET_READ_MISS[5], ADDR_TO_SET_READ_MISS[6], ADDR_TO_SET_READ_MISS[7]}),
    .tridata({ADDRESS_OUT[0], ADDRESS_OUT[1], ADDRESS_OUT[2], ADDRESS_OUT[3], ADDRESS_OUT[4], ADDRESS_OUT[5], ADDRESS_OUT[6], ADDRESS_OUT[7]}));
  not inst2 (inst2_out, load_row_to_cache);
  lpm_bustri0 inst248 (
    .enabledt(inst2_out), .data(ADDRESS),
    .tridata({ADDRESS_OUT[0], ADDRESS_OUT[1], ADDRESS_OUT[2], ADDRESS_OUT[3], ADDRESS_OUT[4], ADDRESS_OUT[5], ADDRESS_OUT[6], ADDRESS_OUT[7]}));
  assign {ADDR[0], ADDR[1], ADDR[2], ADDR[3], ADDR[4], ADDR[5]} = ADDRESS[0:5];  // WIRE inst98
  assign {TEG[0], TEG[1]} = {ADDRESS_OUT[0], ADDRESS_OUT[1]};  // WIRE inst72
  assign {SET[0], SET[1], SET[2], SET[3]} = {ADDRESS_OUT[2], ADDRESS_OUT[3], ADDRESS_OUT[4], ADDRESS_OUT[5]};  // WIRE inst73
  assign {OFFSET[0], OFFSET[1]} = {ADDRESS_OUT[6], ADDRESS_OUT[7]};  // WIRE inst74
  and inst71 (set8_hm, set8, inst59_hit_miss);
  and inst76 (set10_hm, set10, inst60_hit_miss);
  and inst80 (set11_hm, set11, inst61_hit_miss);
  and inst241 (set12_hm, set12, inst62_hit_miss);
  and inst242 (set13_hm, set13, inst63_hit_miss);
  and inst243 (set14_hm, set14, inst64_hit_miss);
  and inst244 (set15_hm, set15, inst65_hit_miss);
  and inst75 (set9_hm, set9, inst52_hit_miss);
  and inst116 (dma_addr, ADDRESS[0], ADDRESS[1], ADDRESS[2], ADDRESS[3], ADDRESS[4], ADDRESS[5]);
  not inst117 (not_dma_addr, dma_addr);
  and inst97 (inst97_out, read_from_set, set0_hm, read_hit);
  and inst121 (inst121_out, read_after_load_row, set0_hm, read_miss);
  and inst105 (inst105_out, read_from_set, set1_hm, read_hit);
  and inst130 (inst130_out, read_after_load_row, set1_hm, read_miss);
  and inst193 (inst193_out, read_from_set, set2_hm, read_hit);
  and inst195 (inst195_out, read_after_load_row, set2_hm, read_miss);
  and inst131 (inst131_out, read_from_set, set3_hm, read_hit);
  and inst192 (inst192_out, read_after_load_row, set3_hm, read_miss);
  and inst196 (inst196_out, read_from_set, set4_hm, read_hit);
  and inst198 (inst198_out, read_after_load_row, set4_hm, read_miss);
  and inst199 (inst199_out, read_from_set, set5_hm, read_hit);
  and inst201 (inst201_out, read_after_load_row, set5_hm, read_miss);
  and inst202 (inst202_out, read_from_set, set6_hm, read_hit);
  and inst204 (inst204_out, read_after_load_row, set6_hm, read_miss);
  and inst205 (inst205_out, read_from_set, set7_hm, read_hit);
  and inst207 (inst207_out, read_after_load_row, set7_hm, read_miss);
  and inst208 (inst208_out, read_from_set, set8_hm, read_hit);
  and inst210 (inst210_out, read_after_load_row, set8_hm, read_miss);
  and inst211 (inst211_out, read_from_set, set9_hm, read_hit);
  and inst213 (inst213_out, read_after_load_row, set9_hm, read_miss);
  and inst214 (inst214_out, read_from_set, set10_hm, read_hit);
  and inst216 (inst216_out, read_after_load_row, set10_hm, read_miss);
  and inst217 (inst217_out, read_from_set, set11_hm, read_hit);
  and inst219 (inst219_out, read_after_load_row, set11_hm, read_miss);
  and inst220 (inst220_out, read_from_set, set12_hm, read_hit);
  and inst222 (inst222_out, read_after_load_row, set12_hm, read_miss);
  and inst223 (inst223_out, read_from_set, set13_hm, read_hit);
  and inst225 (inst225_out, read_after_load_row, set13_hm, read_miss);
  and inst226 (inst226_out, read_from_set, set14_hm, read_hit);
  and inst228 (inst228_out, read_after_load_row, set14_hm, read_miss);
  and inst229 (inst229_out, read_from_set, set15_hm, read_hit);
  and inst231 (inst231_out, read_after_load_row, set15_hm, read_miss);
  or inst101 (set_out0, inst97_out, inst121_out);
  or inst125 (set_out1, inst105_out, inst130_out);
  or inst194 (set_out2, inst193_out, inst195_out);
  or inst134 (set_out3, inst131_out, inst192_out);
  or inst197 (set_out4, inst196_out, inst198_out);
  or inst200 (set_out5, inst199_out, inst201_out);
  or inst203 (set_out6, inst202_out, inst204_out);
  or inst206 (set_out7, inst205_out, inst207_out);
  or inst209 (set_out8, inst208_out, inst210_out);
  or inst212 (set_out9, inst211_out, inst213_out);
  or inst215 (set_out10, inst214_out, inst216_out);
  or inst218 (set_out11, inst217_out, inst219_out);
  or inst221 (set_out12, inst220_out, inst222_out);
  or inst224 (set_out13, inst223_out, inst225_out);
  or inst227 (set_out14, inst226_out, inst228_out);
  or inst230 (set_out15, inst229_out, inst231_out);
  lpm_bustri0 inst250 (
    .enabledt(set_out0),
    .data({SET_0_OUT[0], SET_0_OUT[1], SET_0_OUT[2], SET_0_OUT[3], SET_0_OUT[4], SET_0_OUT[5], SET_0_OUT[6], SET_0_OUT[7]}),
    .tridata(CACHE_OUT));
  lpm_bustri0 inst253 (
    .enabledt(set_out1),
    .data({SET_1_OUT[0], SET_1_OUT[1], SET_1_OUT[2], SET_1_OUT[3], SET_1_OUT[4], SET_1_OUT[5], SET_1_OUT[6], SET_1_OUT[7]}),
    .tridata(CACHE_OUT));
  lpm_bustri0 inst254 (
    .enabledt(set_out2),
    .data({SET_2_OUT[0], SET_2_OUT[1], SET_2_OUT[2], SET_2_OUT[3], SET_2_OUT[4], SET_2_OUT[5], SET_2_OUT[6], SET_2_OUT[7]}),
    .tridata(CACHE_OUT));
  lpm_bustri0 inst267 (
    .enabledt(set_out3),
    .data({SET_3_OUT[0], SET_3_OUT[1], SET_3_OUT[2], SET_3_OUT[3], SET_3_OUT[4], SET_3_OUT[5], SET_3_OUT[6], SET_3_OUT[7]}),
    .tridata(CACHE_OUT));
  lpm_bustri0 inst268 (
    .enabledt(set_out4),
    .data({SET_4_OUT[0], SET_4_OUT[1], SET_4_OUT[2], SET_4_OUT[3], SET_4_OUT[4], SET_4_OUT[5], SET_4_OUT[6], SET_4_OUT[7]}),
    .tridata(CACHE_OUT));
  lpm_bustri0 inst269 (
    .enabledt(set_out5),
    .data({SET_5_OUT[0], SET_5_OUT[1], SET_5_OUT[2], SET_5_OUT[3], SET_5_OUT[4], SET_5_OUT[5], SET_5_OUT[6], SET_5_OUT[7]}),
    .tridata(CACHE_OUT));
  lpm_bustri0 inst271 (
    .enabledt(set_out6),
    .data({SET_6_OUT[0], SET_6_OUT[1], SET_6_OUT[2], SET_6_OUT[3], SET_6_OUT[4], SET_6_OUT[5], SET_6_OUT[6], SET_6_OUT[7]}),
    .tridata(CACHE_OUT));
  lpm_bustri0 inst280 (
    .enabledt(set_out7),
    .data({SET_7_OUT[0], SET_7_OUT[1], SET_7_OUT[2], SET_7_OUT[3], SET_7_OUT[4], SET_7_OUT[5], SET_7_OUT[6], SET_7_OUT[7]}),
    .tridata(CACHE_OUT));
  lpm_bustri0 inst281 (
    .enabledt(set_out8),
    .data({SET_8_OUT[0], SET_8_OUT[1], SET_8_OUT[2], SET_8_OUT[3], SET_8_OUT[4], SET_8_OUT[5], SET_8_OUT[6], SET_8_OUT[7]}),
    .tridata(CACHE_OUT));
  lpm_bustri0 inst282 (
    .enabledt(set_out9),
    .data({SET_9_OUT[0], SET_9_OUT[1], SET_9_OUT[2], SET_9_OUT[3], SET_9_OUT[4], SET_9_OUT[5], SET_9_OUT[6], SET_9_OUT[7]}),
    .tridata(CACHE_OUT));
  lpm_bustri0 inst279 (
    .enabledt(set_out10),
    .data({SET_10_OUT[0], SET_10_OUT[1], SET_10_OUT[2], SET_10_OUT[3], SET_10_OUT[4], SET_10_OUT[5], SET_10_OUT[6], SET_10_OUT[7]}),
    .tridata(CACHE_OUT));
  lpm_bustri0 inst278 (
    .enabledt(set_out11),
    .data({SET_11_OUT[0], SET_11_OUT[1], SET_11_OUT[2], SET_11_OUT[3], SET_11_OUT[4], SET_11_OUT[5], SET_11_OUT[6], SET_11_OUT[7]}),
    .tridata(CACHE_OUT));
  lpm_bustri0 inst277 (
    .enabledt(set_out12),
    .data({SET_12_OUT[0], SET_12_OUT[1], SET_12_OUT[2], SET_12_OUT[3], SET_12_OUT[4], SET_12_OUT[5], SET_12_OUT[6], SET_12_OUT[7]}),
    .tridata(CACHE_OUT));
  lpm_bustri0 inst276 (
    .enabledt(set_out13),
    .data({SET_13_OUT[0], SET_13_OUT[1], SET_13_OUT[2], SET_13_OUT[3], SET_13_OUT[4], SET_13_OUT[5], SET_13_OUT[6], SET_13_OUT[7]}),
    .tridata(CACHE_OUT));
  lpm_bustri0 inst275 (
    .enabledt(set_out14),
    .data({SET_14_OUT[0], SET_14_OUT[1], SET_14_OUT[2], SET_14_OUT[3], SET_14_OUT[4], SET_14_OUT[5], SET_14_OUT[6], SET_14_OUT[7]}),
    .tridata(CACHE_OUT));
  lpm_bustri0 inst274 (
    .enabledt(set_out15),
    .data({SET_15_OUT[0], SET_15_OUT[1], SET_15_OUT[2], SET_15_OUT[3], SET_15_OUT[4], SET_15_OUT[5], SET_15_OUT[6], SET_15_OUT[7]}),
    .tridata(CACHE_OUT));
  or inst48 (inst48_out, set0_hm, set1_hm, set2_hm, set3_hm, set4_hm, set5_hm, set6_hm, set7_hm);
  or inst49 (inst49_out, set8_hm, set9_hm, set10_hm, set11_hm, set12_hm, set13_hm, set14_hm, set15_hm);
  or inst50 (\hit/miss , inst48_out, inst49_out);
  or inst273 (inst273_out, cmd9, cmd0);
  or inst272 (inst272_out, cmd2, cmd0, cmd3);
  or inst94 (inst94_out, cmd2, cmd3);
  or inst6 (inst6_out, cmd4, cmd5, cmd6, cmd7, cmd8, cmd9);
  or inst5 (inst5_out, cmd2, cmd3, cmd4, cmd5, cmd6, cmd7);
  or inst148 (inst148_out, cmd6, cmd7, cmd8, cmd9, cmd10);
  or inst150 (inst150_out, cmd4, cmd5, cmd6, cmd7, cmd8);
  and inst112 (read_after_load_row, inst273_out, read_miss);
  and inst92 (write_to_cache, write_hit, inst94_out);
  or inst102 (inst102_out, write_miss, write_hit);
  or inst132 (inst132_out, cmd7, cmd8, cmd9);
  or inst140 (inst140_out, cmd9, cmd10, cmd11);
  and inst95 (inst95_out, read_miss, cmd2);
  and inst104 (inst104_out, cmd4, write_miss);
  or inst133 (inst133_out, cmd1, cmd2, cmd3);
  and inst136 (read_from_set, inst272_out, read_hit);
  and inst113 (reset_by_read_miss, cmd9, read_miss);
  and inst127 (reset_by_read_hit, cmd3, read_hit);
  and inst122 (reset_by_write_miss, cmd11, write_miss);
  and inst126 (reset_by_write_hit, cmd3, write_hit);
  or inst128 (inst128_out, reset_by_read_miss, reset_by_read_hit, reset_by_write_miss, reset_by_write_hit);
  and inst238 (inst238_out, dma_addr, cmd3);
  or inst262 (inst262_out, cmd1, cmd2, cmd3, cmd4, cmd5, cmd6, cmd7, cmd8);
  or inst264 (inst264_out, cmd9, cmd9);
  and inst107 (inst107_out, write_miss, inst6_out);
  or inst10 (read_from_ram, read_from_ram_wr, read_from_ram_rd);
  and inst123 (inst123_out, read_miss, inst132_out);
  and inst129 (inst129_out, write_miss, inst140_out);
  or inst100 (load_addr, inst95_out, inst104_out);
  or inst16 (inst16_out, write_hit, read_hit);
  or inst265 (inst265_out, inst262_out, inst264_out);
  and inst106 (inst106_out, inst5_out, read_miss);
  and inst110 (inst110_out, write_miss, inst148_out);
  and inst111 (inst111_out, read_miss, inst150_out);
  and inst93 (write_to_ram, inst94_out, inst102_out);
  or inst237 (reset_counter, inst128_out, inst238_out);
  or inst7 (inst7_out, inst107_out, inst106_out);
  or inst17 (update_priorities_by_reload, inst123_out, inst129_out);
  and inst124 (update_priorities_by_read, inst16_out, inst133_out);
  or inst260 (inst260_out, cmd1, cmd2, cmd3, cmd4, cmd5, cmd6, cmd7, cmd7);
  or inst149 (inst149_out, cmd10, inst107_out);
  or inst147 (inst147_out, inst106_out, cmd8);
  or inst11 (load_row_to_cache, inst110_out, inst111_out);
  and inst251 (inst251_out, inst102_out, cmd1);
  or inst296 (inst296_out, cmd2, cmd2, cmd1, cmd3);
  and inst263 (bus_request_by_write_miss, write_miss, inst265_out);
  and inst294 (write_to_dma, cmd3, dma_addr);
  or inst297 (inst297_out, cmd2, cmd3);
  and inst261 (bus_request_by_read_miss, read_miss, inst260_out);
  and inst13 (read_from_ram_wr, write_miss, inst149_out);
  and inst103 (inst103_out, clk, inst7_out);
  and inst9 (read_from_ram_rd, inst147_out, read_miss);
  or inst266 (bus_request_by_write_hit, write_to_ram, inst251_out);
  and inst290 (bus_request_by_dma, inst296_out, dma_addr);
  lpm_counter1 inst283 (
    .sload(load_addr), .data({ADDR[0], ADDR[1], ADDR[2], ADDR[3], ADDR[4], ADDR[5], 2'b00}),
    .clock(inst103_out),
    .q({COUNT_ADDR[0], COUNT_ADDR[1], COUNT_ADDR[2], COUNT_ADDR[3], COUNT_ADDR[4], COUNT_ADDR[5], COUNT_ADDR[6], COUNT_ADDR[7]}));
  and inst292 (to_dma_on_data, inst297_out, dma_addr);
  or inst144 (bus_request, bus_request_by_write_hit, bus_request_by_write_miss, bus_request_by_read_miss, bus_request_by_dma);
  or inst232 (inst232_out, write_to_ram, to_dma_on_data);
  and inst14 (update_reg, cmd3, write_to_cache);
  lpm_bustri0 inst285 (
    .enabledt(load_row_to_cache),
    .data({RAM_OUT[0], RAM_OUT[1], RAM_OUT[2], RAM_OUT[3], RAM_OUT[4], RAM_OUT[5], RAM_OUT[6], RAM_OUT[7]}),
    .tridata({SET_DATA[0], SET_DATA[1], SET_DATA[2], SET_DATA[3], SET_DATA[4], SET_DATA[5], SET_DATA[6], SET_DATA[7]}));
  lpm_bustri0 inst286 (
    .enabledt(write_to_cache), .data(DATA_FROM_CPU),
    .tridata({SET_DATA[0], SET_DATA[1], SET_DATA[2], SET_DATA[3], SET_DATA[4], SET_DATA[5], SET_DATA[6], SET_DATA[7]}));
  lpm_bustri0 inst287 (
    .enabledt(inst232_out), .data(DATA_FROM_CPU),
    .tridata({RAM_IN[0], RAM_IN[1], RAM_IN[2], RAM_IN[3], RAM_IN[4], RAM_IN[5], RAM_IN[6], RAM_IN[7]}));
  lpm_add_sub0 inst284 (
    .dataa({COUNT_ADDR[0], COUNT_ADDR[1], COUNT_ADDR[2], COUNT_ADDR[3], COUNT_ADDR[4], COUNT_ADDR[5], COUNT_ADDR[6], COUNT_ADDR[7]}),
    .result({ADDR_TO_SET_READ_MISS[0], ADDR_TO_SET_READ_MISS[1], ADDR_TO_SET_READ_MISS[2], ADDR_TO_SET_READ_MISS[3], ADDR_TO_SET_READ_MISS[4], ADDR_TO_SET_READ_MISS[5], ADDR_TO_SET_READ_MISS[6], ADDR_TO_SET_READ_MISS[7]}));
  lpm_bustri0 inst289 (
    .enabledt(read_from_ram),
    .data({COUNT_ADDR[0], COUNT_ADDR[1], COUNT_ADDR[2], COUNT_ADDR[3], COUNT_ADDR[4], COUNT_ADDR[5], COUNT_ADDR[6], COUNT_ADDR[7]}),
    .tridata({RAM_ADDR[0], RAM_ADDR[1], RAM_ADDR[2], RAM_ADDR[3], RAM_ADDR[4], RAM_ADDR[5], RAM_ADDR[6], RAM_ADDR[7]}));
  lpm_bustri0 inst288 (
    .enabledt(write_to_ram), .data(ADDRESS),
    .tridata({RAM_ADDR[0], RAM_ADDR[1], RAM_ADDR[2], RAM_ADDR[3], RAM_ADDR[4], RAM_ADDR[5], RAM_ADDR[6], RAM_ADDR[7]}));
  lpm_bustri0 inst291 (
    .enabledt(to_dma_on_data), .data(ADDRESS),
    .tridata({RAM_ADDR[0], RAM_ADDR[1], RAM_ADDR[2], RAM_ADDR[3], RAM_ADDR[4], RAM_ADDR[5], RAM_ADDR[6], RAM_ADDR[7]}));

  // Notes on the sheet:
  //   UPDATE_SETS
  //   READ_SETS
  //   LOAD_SETS
endmodule
